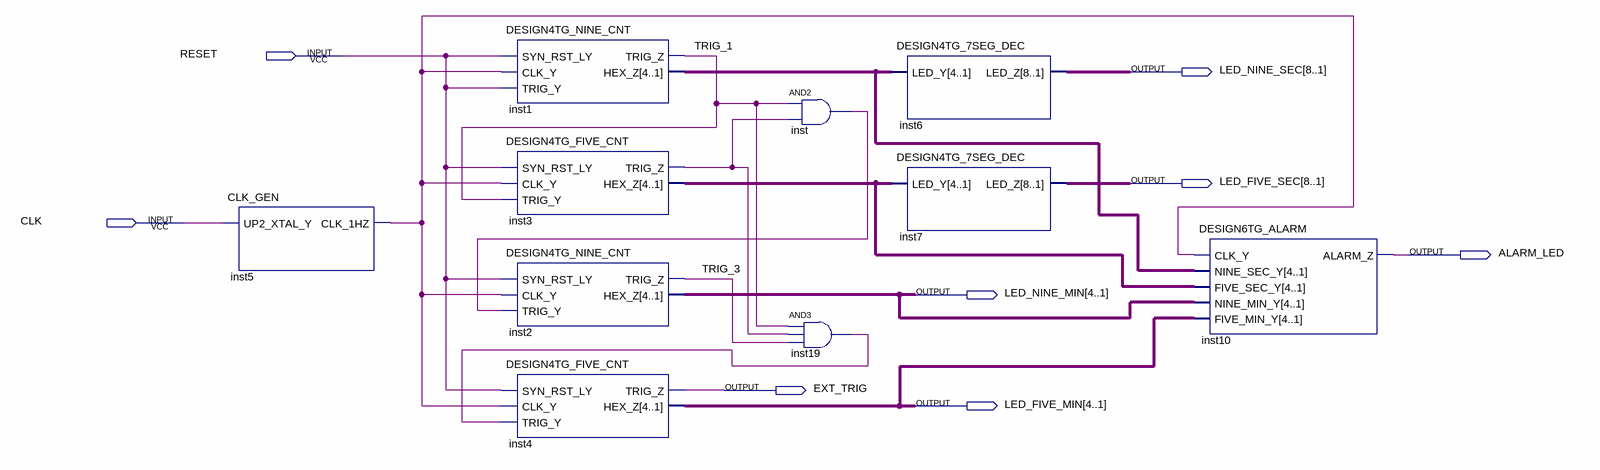
[diagram p0: schematic sheet]
// Quartus schematic DESIGN4TG.bdf as structural Verilog: 10 symbols, 8 pins
module DESIGN4TG (
  input  RESET,
  input  CLK,
  output [8:1] LED_NINE_SEC,
  output [8:1] LED_FIVE_SEC,
  output ALARM_LED,
  output [4:1] LED_NINE_MIN,
  output EXT_TRIG,
  output [4:1] LED_FIVE_MIN
);

  wire inst3_trig_z, inst5_clk_1hz, inst19_out, inst_out, TRIG_1, TRIG_3;
  wire [3:0] inst1_hex_z, inst3_hex_z;

  CLK_GEN inst5 (.UP2_XTAL_Y(CLK), .CLK_1HZ(inst5_clk_1hz));
  DESIGN4TG_NINE_CNT inst1 (
    .SYN_RST_LY(RESET), .CLK_Y(inst5_clk_1hz), .TRIG_Y(RESET), .TRIG_Z(TRIG_1), .HEX_Z(inst1_hex_z));
  DESIGN4TG_FIVE_CNT inst3 (
    .SYN_RST_LY(RESET), .CLK_Y(inst5_clk_1hz), .TRIG_Y(TRIG_1), .TRIG_Z(inst3_trig_z), .HEX_Z(inst3_hex_z));
  DESIGN4TG_NINE_CNT inst2 (
    .SYN_RST_LY(RESET), .CLK_Y(inst5_clk_1hz), .TRIG_Y(inst_out), .TRIG_Z(TRIG_3), .HEX_Z(LED_NINE_MIN));
  DESIGN4TG_FIVE_CNT inst4 (
    .SYN_RST_LY(RESET), .CLK_Y(inst5_clk_1hz), .TRIG_Y(inst19_out), .TRIG_Z(EXT_TRIG), .HEX_Z(LED_FIVE_MIN));
  and inst (inst_out, TRIG_1, inst3_trig_z);
  and inst19 (inst19_out, TRIG_1, inst3_trig_z, TRIG_3);
  DESIGN4TG_7SEG_DEC inst6 (.LED_Y(inst1_hex_z), .LED_Z(LED_NINE_SEC));
  DESIGN4TG_7SEG_DEC inst7 (.LED_Y(inst3_hex_z), .LED_Z(LED_FIVE_SEC));
  DESIGN6TG_ALARM inst10 (
    .CLK_Y(inst5_clk_1hz), .NINE_SEC_Y(inst1_hex_z), .FIVE_SEC_Y(inst3_hex_z), .NINE_MIN_Y(LED_NINE_MIN),
    .FIVE_MIN_Y(LED_FIVE_MIN), .ALARM_Z(ALARM_LED));
endmodule
